# EasyEDA schematic SCH_Gardening_System_Monitor_2021-09-22.json
TITLE: Garden Monitor; REV: 1.0; Date: 2021-06-15; Sheet: 1/1; Drawn By: RechardP2021; Company: Soutie's Sandbox
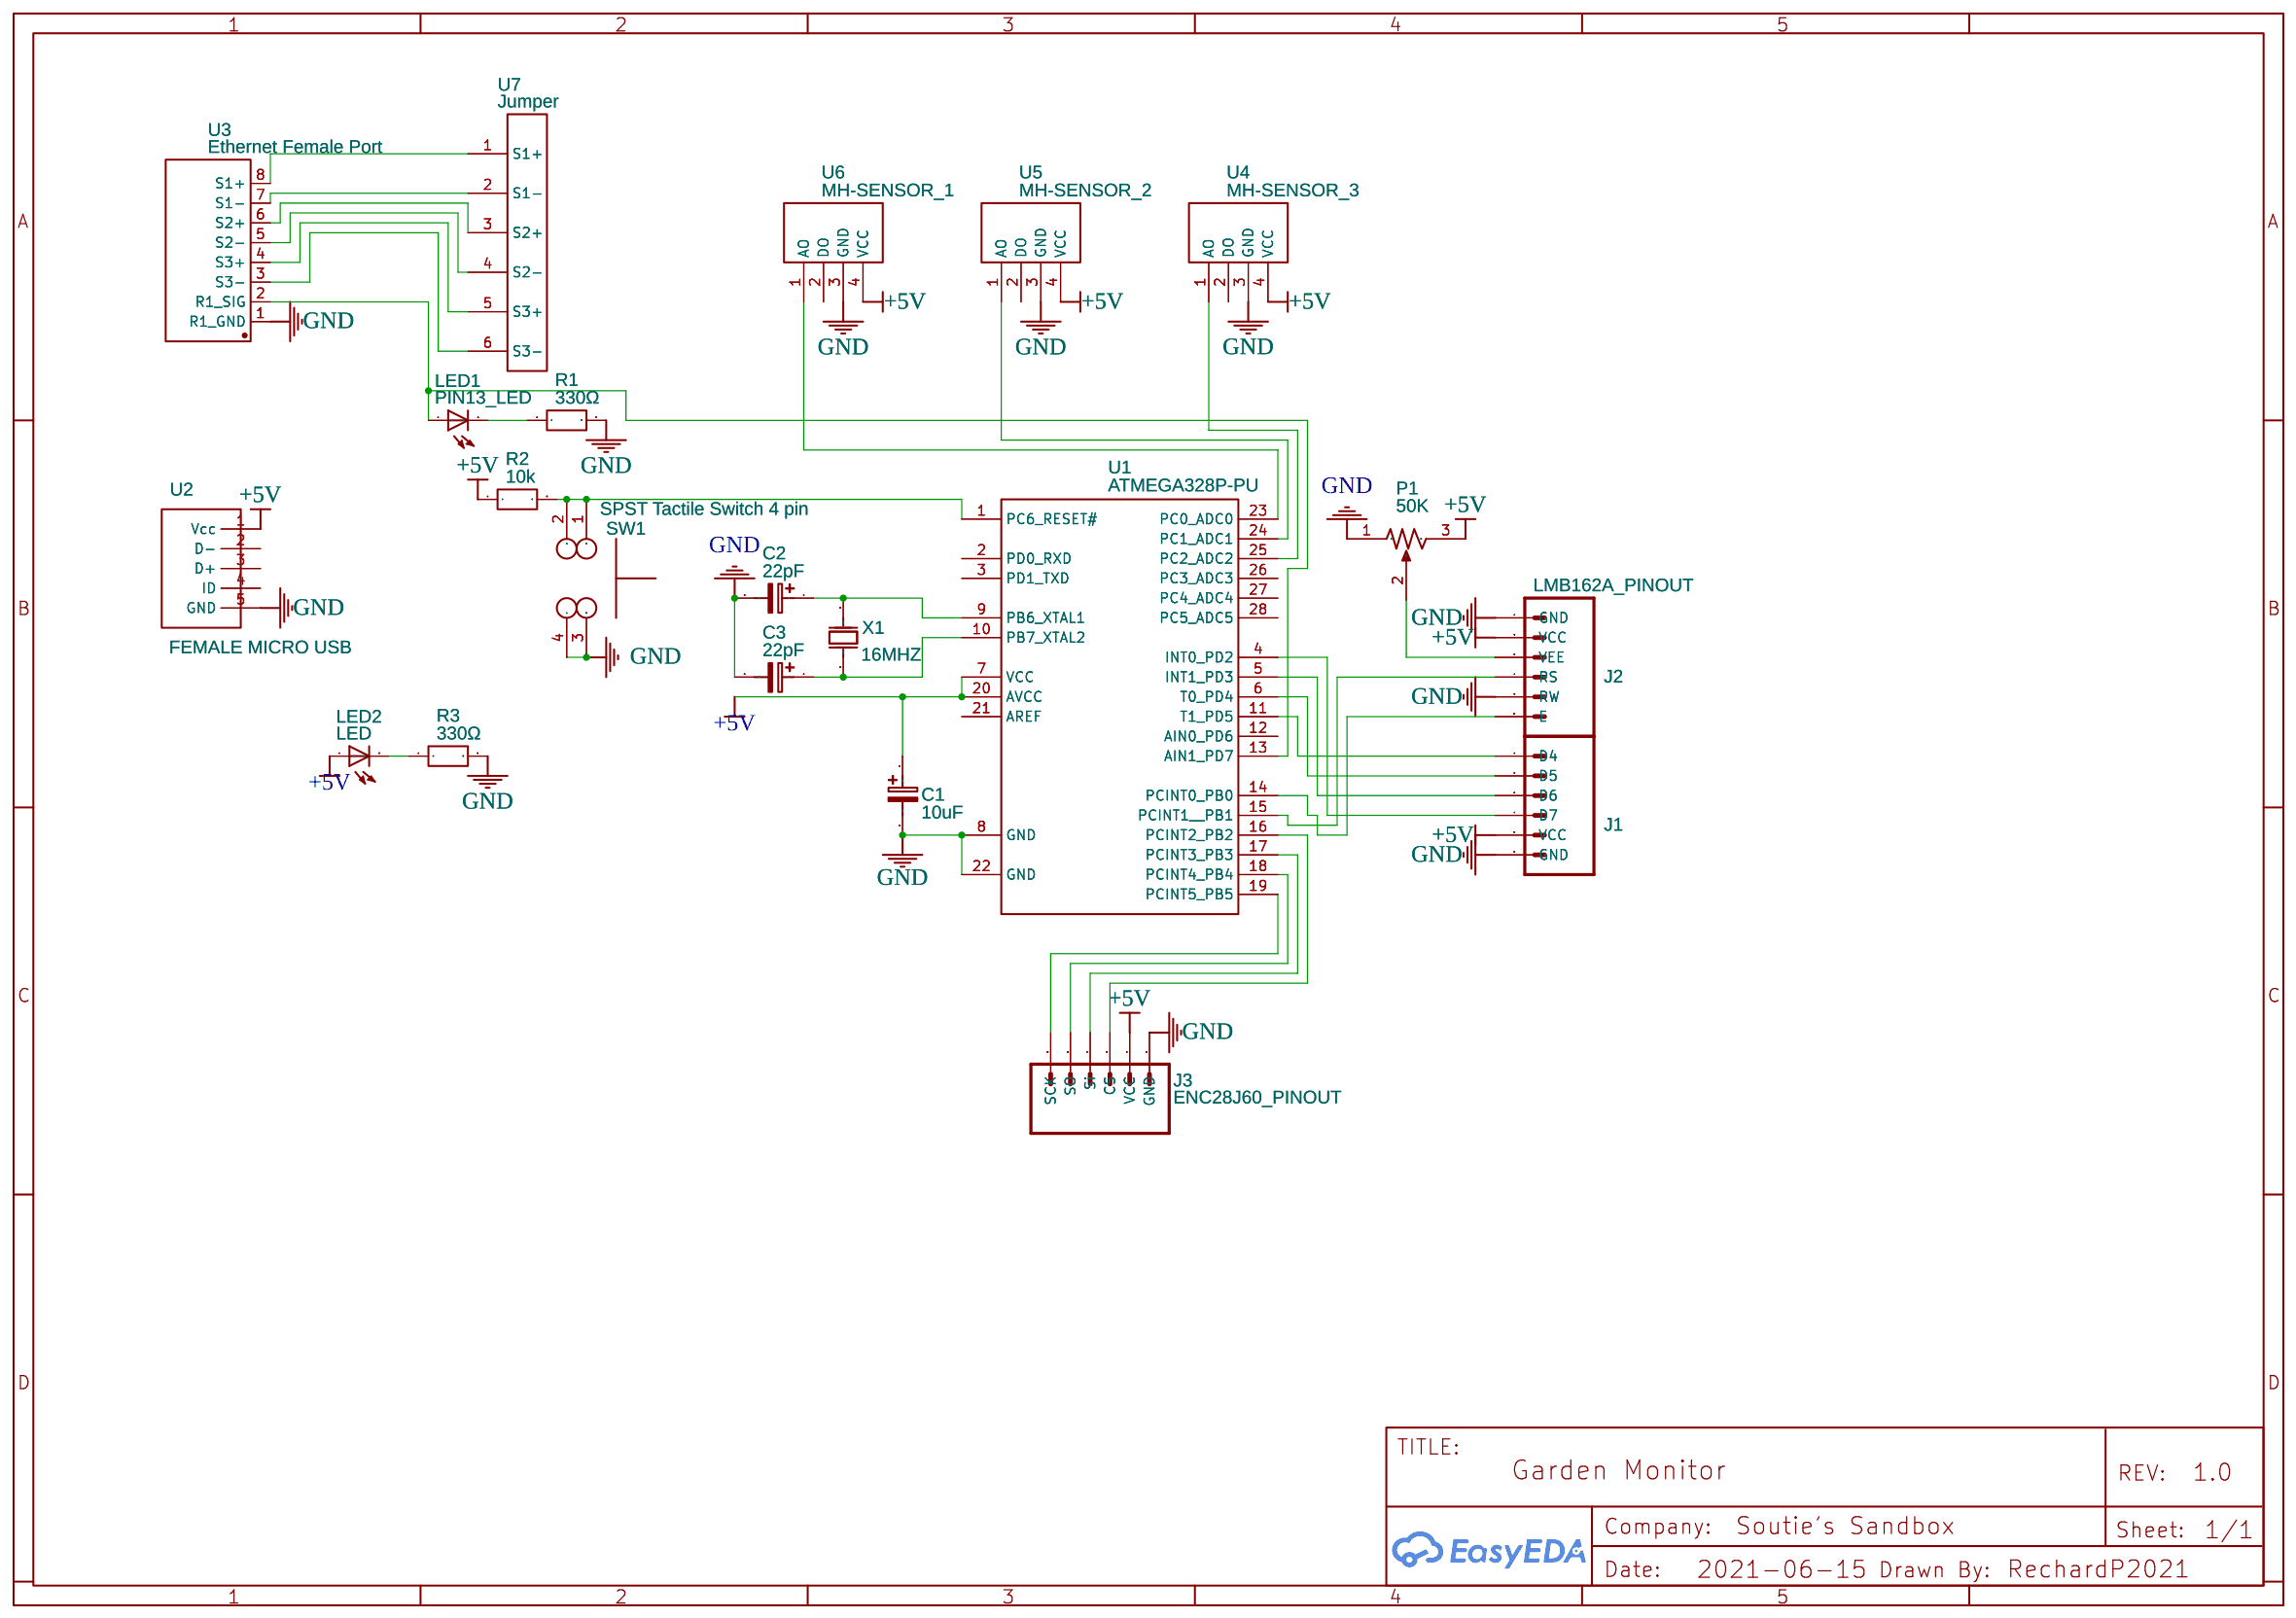
[diagram p0: schematic sheet]

## Parts
C1  10uF  [CAP-D10.0XF5.0]
C2  22pF  [CAP-D10.0XF5.0]
C3  22pF  [CAP-D10.0XF5.0]
J1  6_PIN_SERIAL_TARGET  [1X06]
J2  LMB162A_PINOUT  [1X06]
J3  ENC28J60_PINOUT  [1X06]
LED1  PIN13_LED  [LED3MM]
LED2  LED  [LED3MM]
P1  50K  [POTE SENCILLO]
R1  330Ω  [RESISTOR]
R2  10k  [RESISTOR]
R3  330Ω  [RESISTOR]
SW1  SPST Tactile Switch 4 pin  [SW-TH_4P-L6.0-W6.0-P4.50-LS6.5]
U1  ATMEGA328P-PU  [DIP-28_L34.6-W7.3-P2.54-LS10.2-BL]
U2  FEMALE MICRO USB  [FEMALE MICRO USB]
U3  Ethernet Female Port  [ETHERNET-FEMALE]
U4  MH-SENSOR_3  [HDR1X4]
U5  MH-SENSOR_2  [HDR1X4]
U6  MH-SENSOR_1  [HDR1X4]
U7  Jumper  [PIN6 COPY]
X1  16MHZ  [OSC-49S-1]

## Library data of the parts
C1-C3 = Capacitor
J1-J3 = 6_PIN_SERIAL_TARGET: Contributor: osirisizs
LED1 LED2 = LED: Contributor: marcosbg
P1 = pote 50k: link: capo electronics; Contributor: capoelectronics
R1-R3 = RESISTOR: Supplier: LCSC; Supplier Part: C714085; Manufacturer: Huaxing Mechanical-Elec.; Manufacturer Part: MF1/2W-100KΩ±1%T52; Contributor: LCSC
SW1 = SPST Tactile Switch 4 pin: Manufacturer: Dongguan Guangzhu Industrial; Manufacturer Part: C13828; Supplier: LCSC; Supplier Part: C13828; link: https://lcsc.com/product-detail/Tactile-Switches_Dongguan-Guangzhu-Industrial-C13828_C13828.html; Contributor: surajmdth
U1 = ATMEGA328P-PU: sourceId: Oic6oiASL; Supplier: LCSC; Manufacturer: MICROCHIP; Contributor: LCSC; Supplier Part: C33901; JLCPCB Part Class: Extended Part
U2 = FEMALE MICRO USB: Supplier: LCSC; Supplier Part: C40953; Contributor: Janissary03
U3 = Ethernet Female Port
U4-U6 = SCREEN PINS: Manufacturer Part: pin; Contributor: Water
U7 = pin6: Manufacturer Part: pin3; Contributor: ghbdtn2244
X1 = 16MHZ: EasyEDA: C16212; Supplier Part: C16212; Supplier: EasyEDA; Manufacturer: EasyEDA; Manufacturer Part: X49SD16MSD2SC

## Nets
+5V: C1.1 J1.5(VCC) J2.2(VCC) J3.2(VCC) LED2.1(A) P1.3 R2.1 U1.7(VCC) U1.20(AVCC) U2.1(Vcc) U4.4(VCC) U5.4(VCC) U6.4(VCC)
GND: C1.2 C2.2 C3.2 J1.6(GND) J2.1(GND) J2.5(RW) J3.1(GND) P1.1 R1.2 R3.2 SW1.3 SW1.4 U1.8(GND) U1.22(GND) U2.5(GND) U3.1(R1_GND) U4.3(GND) U5.3(GND) U6.3(GND)
Net-(C2-1): C2.1 U1.9(PB6 XTAL1) X1.2(OSC2)
Net-(C3-1): C3.1 U1.10(PB7 XTAL2) X1.1(OSC1)
Net-(J1-1): J1.1(D4) U1.11(T1 PD5)
Net-(J1-2): J1.2(D5) U1.6(T0 PD4)
Net-(J1-3): J1.3(D6) U1.5(INT1 PD3)
Net-(J1-4): J1.4(D7) U1.4(INT0 PD2)
Net-(J2-3): J2.3(VEE) P1.2
Net-(J2-4): J2.4(RS) U1.15(PCINT1  PB1)
Net-(J2-6): J2.6(E) U1.14(PCINT0 PB0)
Net-(J3-3): J3.3(CS) U1.16(PCINT2 PB2)
Net-(J3-4): J3.4(Si) U1.17(PCINT3 PB3)
Net-(J3-5): J3.5(SO) U1.18(PCINT4 PB4)
Net-(J3-6): J3.6(SCK) U1.19(PCINT5 PB5)
Net-(LED1-1): LED1.1(A) U1.13(AIN1 PD7) U3.2(R1_SIG)
Net-(LED1-2): LED1.2(C) R1.1
Net-(LED2-2): LED2.2(C) R3.1
Net-(R2-2): R2.2 SW1.1 SW1.2 U1.1(PC6 RESET#)
Net-(U1-23): U1.23(PC0 ADC0) U6.1(AO)
Net-(U1-24): U1.24(PC1 ADC1) U5.1(AO)
Net-(U1-25): U1.25(PC2 ADC2) U4.1(AO)
Net-(U3-3): U3.3(S3-) U7.6(S3-)
Net-(U3-4): U3.4(S3+) U7.5(S3+)
Net-(U3-5): U3.5(S2-) U7.4(S2-)
Net-(U3-6): U3.6(S2+) U7.3(S2+)
Net-(U3-7): U3.7(S1-) U7.2(S1-)
Net-(U3-8): U3.8(S1+) U7.1(S1+)

Not connected (* = marked no-connect by the designer): U1 2(PD0 RXD) 3(PD1 TXD) 12(AIN0 PD6) 21(AREF) 26(PC3 ADC3) 27(PC4 ADC4) 28(PC5 ADC5); U2 2(D-) 3(D+) 4(ID); U4 2(DO); U5 2(DO); U6 2(DO)
